# EAGLE design demoboard_V2b (EAGLE 5.09)
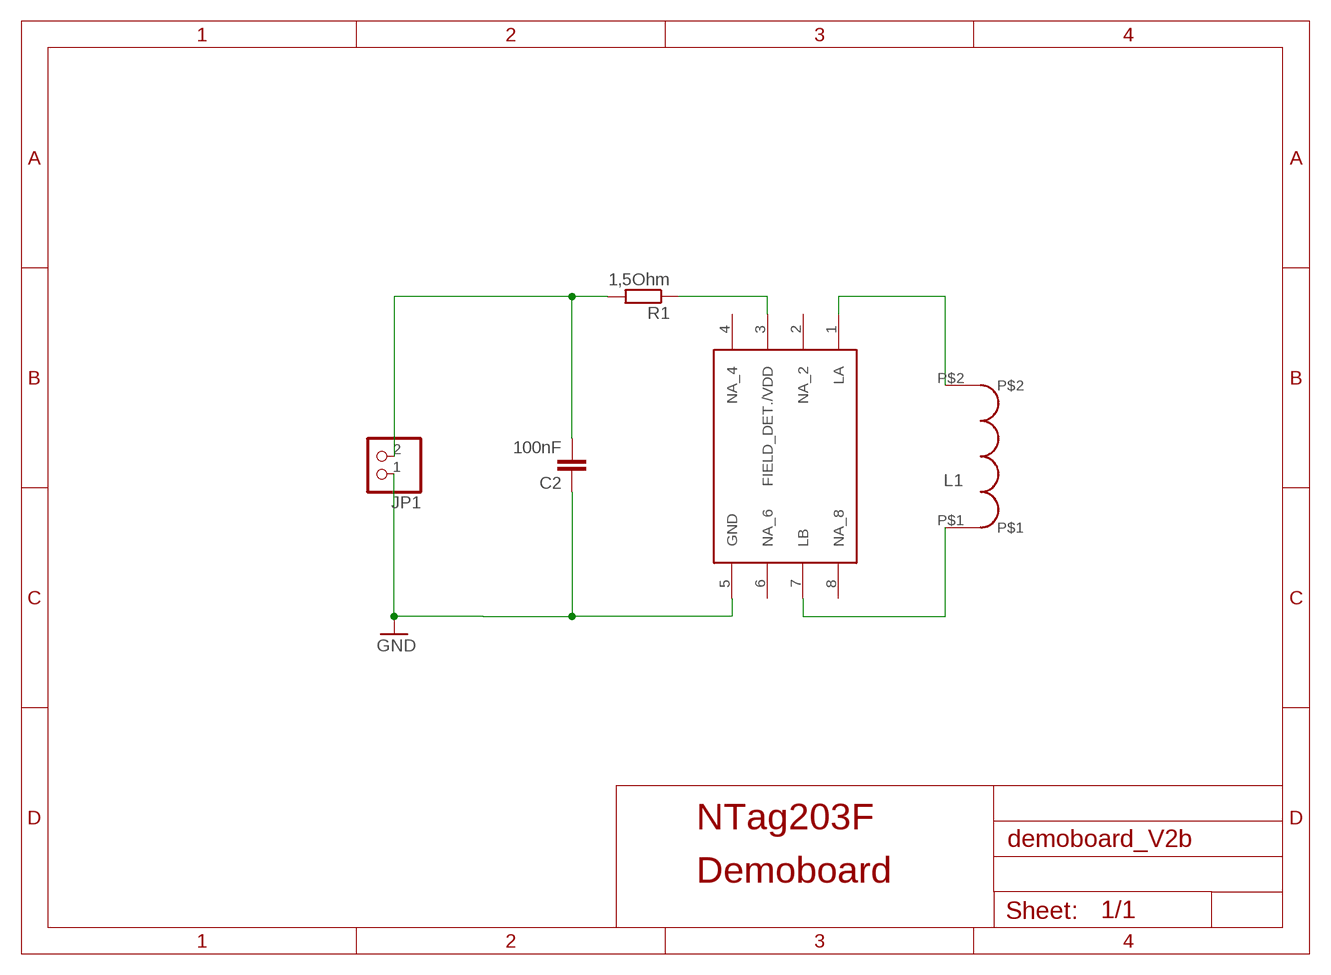
[diagram p0: schematic, sheet 1]

## Parts
C2  100nF  C-EUC0805  [C0805]
JP1  PINHD-1X2/90  [1X02/90]
L1  CLASS_05_50PF_01  [L_PICC_CLASS5_50PF_01]
R1  1,5Ohm  R-EU_M0805  [M0805]
U$1  NTAG203F  [SOT1069-2]

## Nets
GND: C2.1 JP1.1 U$1.5(GND)
N$1: L1.P$1 U$1.7(LB)
N$2: L1.P$2 U$1.1(LA)
N$3: C2.2 JP1.2 R1.2
N$9: R1.1 U$1.3(FIELD_DET./VDD)
Unconnected: U$1.2(NA_2) U$1.4(NA_4) U$1.6(NA_6) U$1.8(NA_8)

## Notes on the sheet
- NTag203F
- Demoboard

## Library data of the parts
C2 = rcl:C-EU: CAPACITOR, European symbol
JP1 = pinhead:PINHD-1X2: PIN HEADER
L1 = NXP_PICC_Antennas:CLASS_05_50PF_01: Class 5 Antenna - 50 pF #01 Size: 40 x 24 mm Width: 0.3 mm Gap: 0.55 mm Turns: 6
R1 = rcl:R-EU_: RESISTOR, European symbol
U$1 = NXP:NTAG203F

## Board
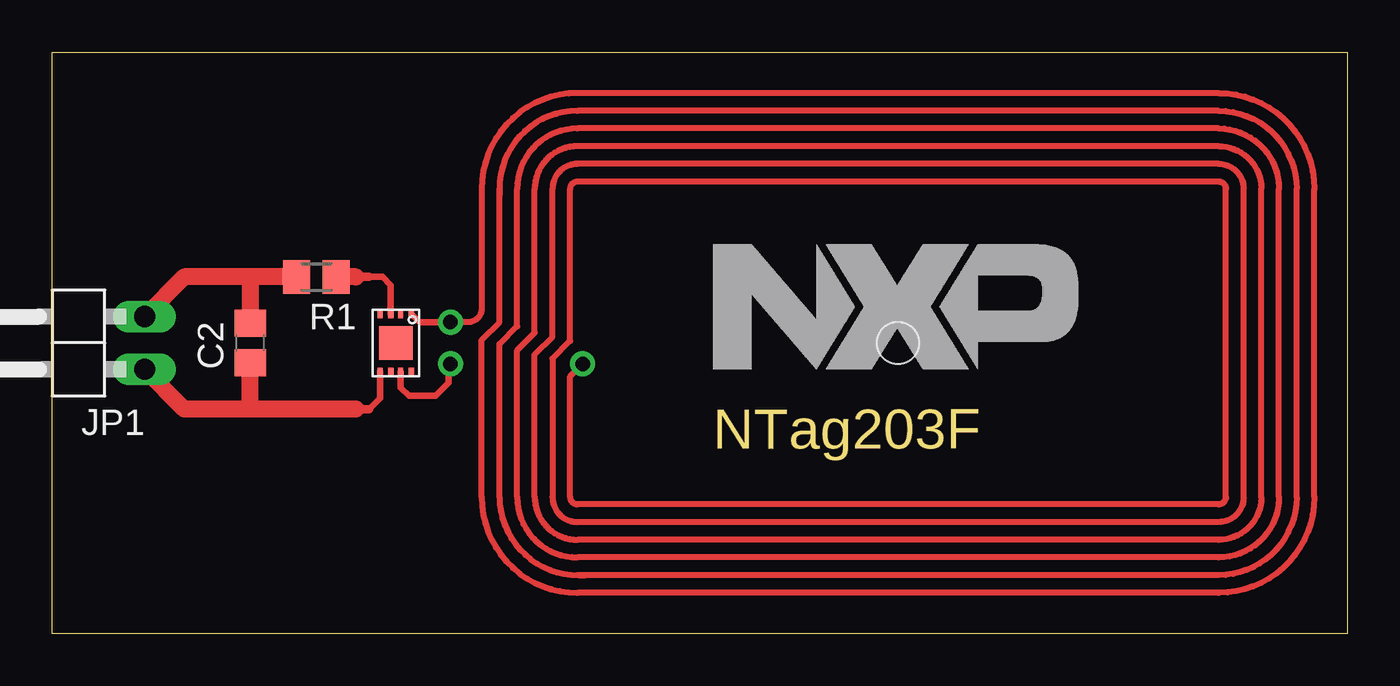
[diagram p1: board, top side]
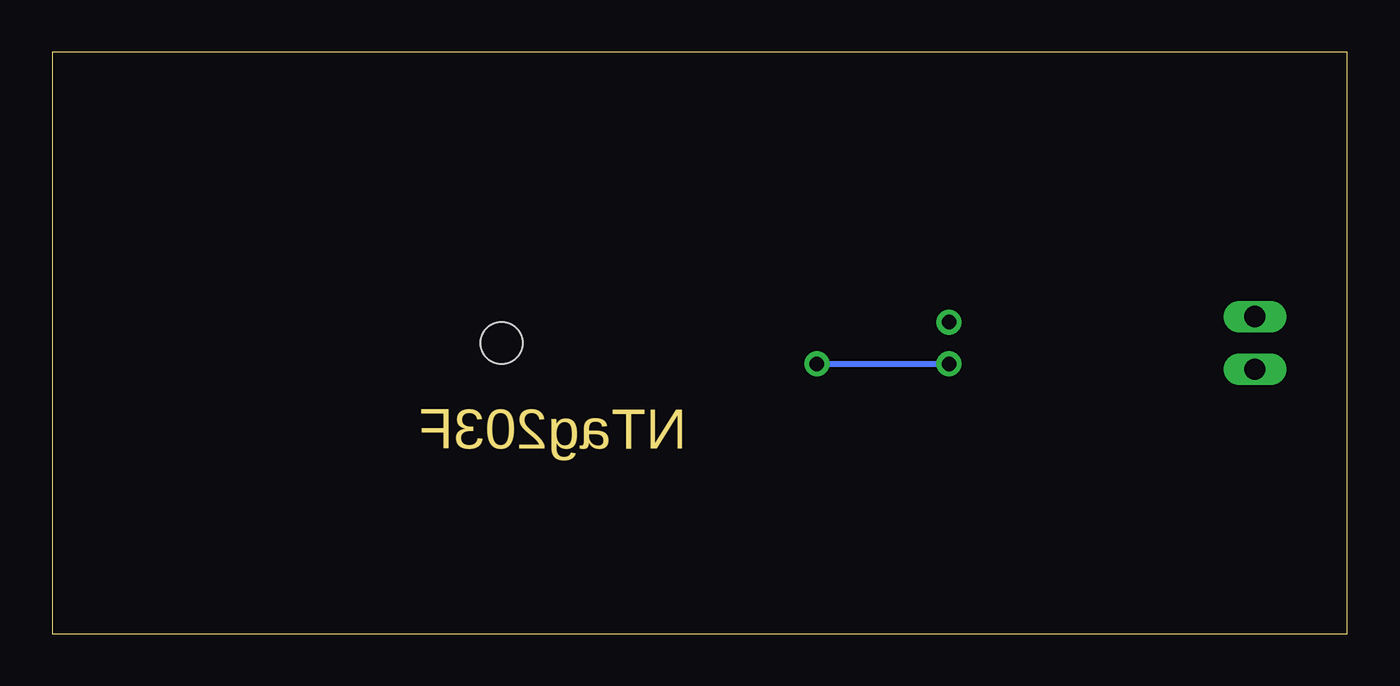
[diagram p2: board, bottom side, seen from below]

Size 62.23 x 27.94 mm. Coordinates in mm from the lower left corner, seen from the top.
Outline: 0,13.97 0,27.94 62.23,27.94 62.23,25.4 62.23,0 0,0 0,13.97
Copper layers (1*16): Top 0.035mm / dielectric 1.5mm / Bottom 0.035mm
Design rules "default": minimum track width 10mil, minimum drill 24mil, track to track 8mil, track to pad 8mil, pad to pad 8mil, via to via 8mil, smd to smd 8mil, copper to edge 40mil, drill to drill 8mil, minimum pad ring 10mil, minimum via ring 8mil, stop-mask expansion 4mil, vias tented up to drill 0mil, thermal gap 10mil

### Footprints (pad centres in the part's own frame; a part is rotated, then mirrored left to right if it is on the bottom)
C0805 = smd 1.3 x 1.5: 1 -0.95,0; 2 0.95,0
1X02/90 = drill 1.016 long: 1 -1.27,-3.81; 2 1.27,-3.81
L_PICC_CLASS5_50PF_01 = drill 0.7 round: P$1 21.5,1; P$2 21.5,-1; P$3 15.15,1 | hole 2: 0,0
M0805 = smd 1.3 x 1.6: 1 -0.95,0; 2 0.95,0
SOT1069-2 = smd 0.4 x 0.25: 1 -1.389,0.754; 2 -1.389,0.238; 3 -1.389,-0.238; 4 -1.389,-0.754; 5 1.389,-0.754; 6 1.389,-0.238; 7 1.389,0.238; 8 1.389,0.754 | smd 1.6 x 1.6: P$1 0,0

### Placement (x,y rotation side)
C2  9.53,13.97 90 top
JP1  0.63,13.97 90 top
L1  40.64,13.97 180 top
R1  12.7,17.14 180 top
U$1  16.51,13.97 270 top
U$3  [LOGO]  31.75,12.7 0 top

### Tracks (layer width: path | path; a pad name or v marks a point on that pad's centre or on a via)
GND
  Top 0.305: U$1.5 15.76,11.31 15.24,10.8
  Top 0.406: 15.24,10.8 14.61,10.8
  Top 0.813: 14.61,10.8 9.53,10.8 | 9.53,10.8 6.35,10.8 JP1.1 | 9.53,10.8 C2.1
N$1
  Top 0.305: U$1.7 16.75,11.83 17.14,11.43 18.41,11.43 19.05,12.07 19.05,12.88 L1.P$1
N$2
  Top 0.305: L1.P$2 17.65,14.97 U$1.1
N$3
  Top 0.813: R1.2 9.53,17.14 | 9.53,17.14 6.35,17.14 JP1.2 | 9.53,17.14 C2.2
N$9
  Top 0.305: U$1.3 16.27,16.75 15.88,17.14 15.24,17.14
  Top 0.406: 15.24,17.14 14.61,17.14
  Top 0.813: 14.61,17.14 R1.1

### Text on the board
Dimension: NTag203F